# Altium project PE2.PrjPcb
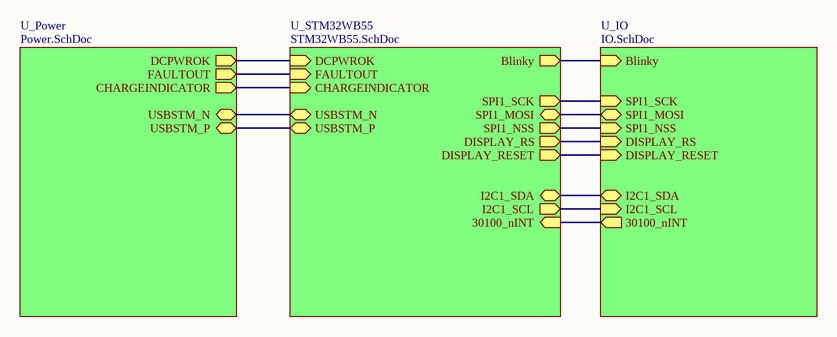
[diagram p0: TOP.SchDoc]
3 sheets, 50 parts. Net scope: hierarchical (ports join the sheet entries above them; power ports are global).
Sheets:
  TOP.SchDoc
    U_IO = IO.SchDoc
    U_Power = Power.SchDoc

## Sheet TOP.SchDoc: HB+SPO2 READER | TOP
size A4; DocumentNumber: 4; Revision: 1; SheetNumber: 1; SheetTotal: 4

### Sub-sheets
U_IO = IO.SchDoc: Blinky (in), I2C1_SDA (bidir), I2C1_SCL (in), SPI1_MOSI (bidir), SPI1_SCK (in), SPI1_NSS (in), DISPLAY_RS (in), DISPLAY_RESET (in), 30100_nINT (out)
U_Power = Power.SchDoc: DCPWROK (out), FAULTOUT (out), CHARGEINDICATOR (out), USBSTM_P (bidir), USBSTM_N (bidir)
U_STM32WB55 = STM32WB55.SchDoc (file not in this document): USBSTM_N (bidir), USBSTM_P (bidir), DCPWROK (in), FAULTOUT (in), CHARGEINDICATOR (in), Blinky (out), I2C1_SDA (bidir), I2C1_SCL (out), SPI1_MOSI (bidir), SPI1_SCK (out), SPI1_NSS (out), DISPLAY_RS (out), DISPLAY_RESET (out), 30100_nINT (in)

### Nets
CHARGEINDICATOR: sheet U_Power/CHARGEINDICATOR, sheet U_STM32WB55/CHARGEINDICATOR
DCPWROK: sheet U_Power/DCPWROK, sheet U_STM32WB55/DCPWROK
FAULTOUT: sheet U_Power/FAULTOUT, sheet U_STM32WB55/FAULTOUT
USBSTM_N: sheet U_Power/USBSTM_N, sheet U_STM32WB55/USBSTM_N
USBSTM_P: sheet U_Power/USBSTM_P, sheet U_STM32WB55/USBSTM_P
NetD1_1: sheet U_IO/Blinky, sheet U_STM32WB55/Blinky
NetU7_1: sheet U_IO/DISPLAY_RESET, sheet U_STM32WB55/DISPLAY_RESET
NetU7_3: sheet U_IO/DISPLAY_RS, sheet U_STM32WB55/DISPLAY_RS
NetU7_4: sheet U_IO/SPI1_MOSI, sheet U_STM32WB55/SPI1_MOSI
NetU7_5: sheet U_IO/SPI1_SCK, sheet U_STM32WB55/SPI1_SCK
NetU7_6: sheet U_IO/SPI1_NSS, sheet U_STM32WB55/SPI1_NSS
NetU7_7: sheet U_IO/I2C1_SCL, sheet U_STM32WB55/I2C1_SCL
NetU7_8: sheet U_IO/I2C1_SDA, sheet U_STM32WB55/I2C1_SDA
NetU7_9: sheet U_IO/30100_nINT, sheet U_STM32WB55/30100_nINT

### Notes on the sheet
- Title
- Size:
- Date:
- A4
- Number:
- Time:
- Revision:
- Sheet
- of
- ShareFox
- ©
- File:

## Sheet IO.SchDoc: HB+SPO2 READER | IO
size A4; DocumentNumber: 3; Revision: 1; SheetNumber: 4; SheetTotal: 4
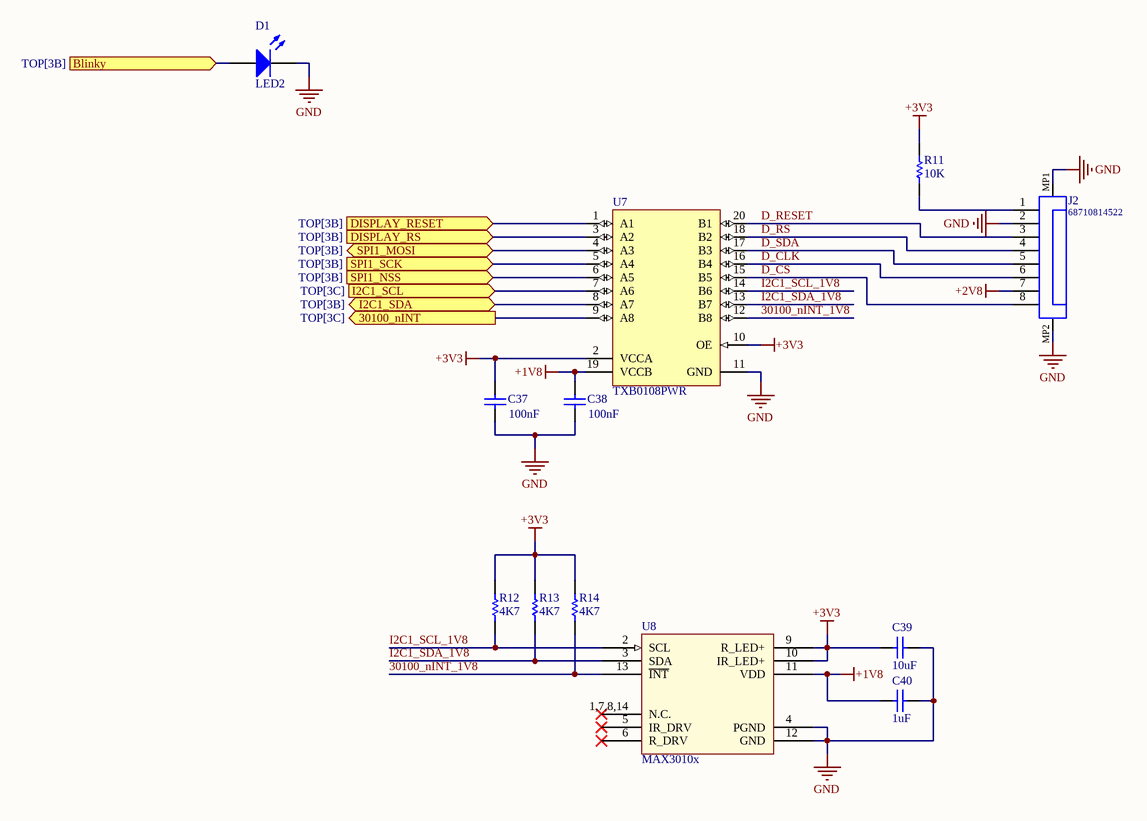
[diagram p1: IO.SchDoc]

### Parts
C37  value 100nF  [C_0603]  (hidden comment: Cap)
C38  value 100nF  [C_0603]  (hidden comment: Cap)
C39  value 10uF  [C_0603]  (hidden comment: Cap)
C40  value 1uF  [C_0603]  (hidden comment: Cap)
D1  LED2  [D-0603]
J2  68710814522  [68710814522]
R11  value 10K  [C_0603]  (hidden comment: Res1)
R12  value 4K7  [C_0603]  (hidden comment: Res1)
R13  value 4K7  [C_0603]  (hidden comment: Res1)
R14  value 4K7  [C_0603]  (hidden comment: Res1)
U7  TXB0108PWR  [PW0020A_L]
U8  MAX3010x  [OESIP14R560x330]

### Ports
30100_nINT (out, see TOP[3C]), Blinky (in, see TOP[3B]), DISPLAY_RESET (in, see TOP[3B]), DISPLAY_RS (in, see TOP[3B]), I2C1_SCL (in, see TOP[3C]), I2C1_SDA (bidir, see TOP[3B]), SPI1_MOSI (bidir, see TOP[3B]), SPI1_NSS (in, see TOP[3B]), SPI1_SCK (in, see TOP[3B])

### Nets
+1V8: C38.2 C40.2 U7.19(VCCB) U8.11(VDD)
+2V8: J2.7
+3V3: C37.2 C39.2 R11.1 R12.2 R13.2 R14.2 U7.2(VCCA) U7.10(OE) U8.9(R_LED+) U8.10(IR_LED+)
GND: C37.1 C38.1 C39.1 C40.1 D1.2(K) J2.2 J2.MP1 J2.MP2 U7.11(GND) U8.4(PGND) U8.12(GND)
30100_nINT_1V8: R14.1 U7.12(B8) U8.13(~{INT})
D_CLK: J2.6 U7.16(B4)
D_CS: J2.8 U7.15(B5)
D_RESET: J2.3 U7.20(B1)
D_RS: J2.4 U7.18(B2)
D_SDA: J2.5 U7.17(B3)
I2C1_SCL_1V8: R12.1 U7.14(B6) U8.2(SCL)
I2C1_SDA_1V8: R13.1 U7.13(B7) U8.3(SDA)
NetD1_1: D1.1(A) ; port Blinky
NetJ2_1: J2.1 R11.2
NetU7_1: U7.1(A1) ; port DISPLAY_RESET
NetU7_3: U7.3(A2) ; port DISPLAY_RS
NetU7_4: U7.4(A3) ; port SPI1_MOSI
NetU7_5: U7.5(A4) ; port SPI1_SCK
NetU7_6: U7.6(A5) ; port SPI1_NSS
NetU7_7: U7.7(A6) ; port I2C1_SCL
NetU7_8: U7.8(A7) ; port I2C1_SDA
NetU7_9: U7.9(A8) ; port 30100_nINT

Not connected (* = marked no-connect by the designer): U8 1,7,8,14(N.C.)* 5(IR_DRV)* 6(R_DRV)*

### Notes on the sheet
- Title
- Size:
- Date:
- A4
- Number:
- Time:
- Revision:
- Sheet
- of
- ShareFox
- ©
- File:

### Library data of the parts
C37-C40 = Cap: Capacitor; Published: 8-Jun-2000; LatestRevisionDate: 17-Jul-2002; LatestRevisionNote: Re-released for DXP Platform.; PackageReference: RAD-0.3; Publisher: Altium Limited; PackageDescription: Radial Cap, Thru-Hole; 2 Leads; 0.3 in Pin Spacing
D1 = LED2: Typical RED, GREEN, YELLOW, AMBER GaAs LED; Published: 8-Jun-2000; LatestRevisionDate: 17-Jul-2002; LatestRevisionNote: Re-released for DXP Platform.; PackageVersion: Feb-2002; PackageReference: 3.2X1.6X1.1; Publisher: Altium Limited; PackageDescription: SM LED; 2 Flat Leads
J2 = CMP-1502-01528-1: SMT ZIF Connectors WR-FPC, Horizontal, Bottom Contact, pitch 0.5 mm, 8 pins; Manufacturer: Wurth Elektronik; Contact Resistance: 20mOhm; Pitch: 0.5mm; Withstanding Voltage: 250VAC; Working Voltage: 50VAC; Pin Number: 8; Rated Current: 0.5A; Contact Design: BottomContact; Publisher: WurthElektronik; Orientation: Horizontal; Manufacturer URL: http://www.we-online.de; Part Number: 68710814522; Mounting Technology: SMT; Packaging: TapeandReel; Package Reference: 68710814522; Operating Temperature: -25to85degC; Datasheet URL: https://katalog.we-online.de/em/datasheet/68710814522.pdf
R11-R14 = Res1: Resistor; Published: 8-Jun-2000; LatestRevisionDate: 17-Jul-2002; LatestRevisionNote: Re-released for DXP Platform.; PackageReference: AXIAL-0.3; Publisher: Altium Limited; PackageDescription: Axial Device, Thru-Hole; 2 Leads; 0.3 in Pin Spacing
U7 = CMP-2000-07337-1: TXB0108 8-Bit Bidirectional Voltage-Level Translator with Auto-Direction Sensing and / +/- 15-kV ESD Protection, 1.2 to 3.6 V, -40 to 85 degC, 20-Pin TSSOP (PW), Green (RoHS & no Sb/Br), Tape and Reel; Manufacturer: Texas Instruments; Propagation Delay (Max): 4ns; Logic Function: Translator,Bidirectional; Input Type: Logic; Package Version: 4040064-5/G, 02/2011; Voltage - Supply: 1.2V~3.6V,1.65V~5.5V; Data Rate: 100Mbps; Other Names: 296-21527-6; Number of Channels: 8; Differential - Input: Output:No/No; Number of Outputs/Channel: 1; Product Training Modules: VoltageLevelTranslation; Dynamic Catalog: TXBSeries; Package Reference: PW20; Package Description: 20-Pin Small Outline Package Integrated Circuit, Body 6.5 x 4.4 mm, Pitch 0.65 mm; Category: IntegratedCircuits(ICs); Datasheet URL: http://www.ti.com/general/docs/lit/getliterature.tsp?genericPartNumber=TXB0108&fileType=pdf; Package / Case: 20-TSSOP(0.173",4.40mmWidth); Family: Logic-Translators; Standard Package: 1; Series: -; Manufacturer URL: http://www.ti.com/; Number of Bits: 8; Package URL: http://www.ti.com/litv/pdf/mpds362; Output Type: Logic; Datasheet Version: Rev. F, 12/2014; Packaging: Digi-Reel®; Operating Temperature: -40°C~85°C; Supplier Device Package: 20-TSSOP; Mounting Technology: SurfaceMount
U8 = MAX3010x: Pulse Oximeter and Heart-Rate Sensor IC  for Wearable Health

## Sheet Power.SchDoc: HB+SPO2 READER | POWER
size A4; DocumentNumber: 1; Revision: 1; SheetNumber: 2; SheetTotal: 4
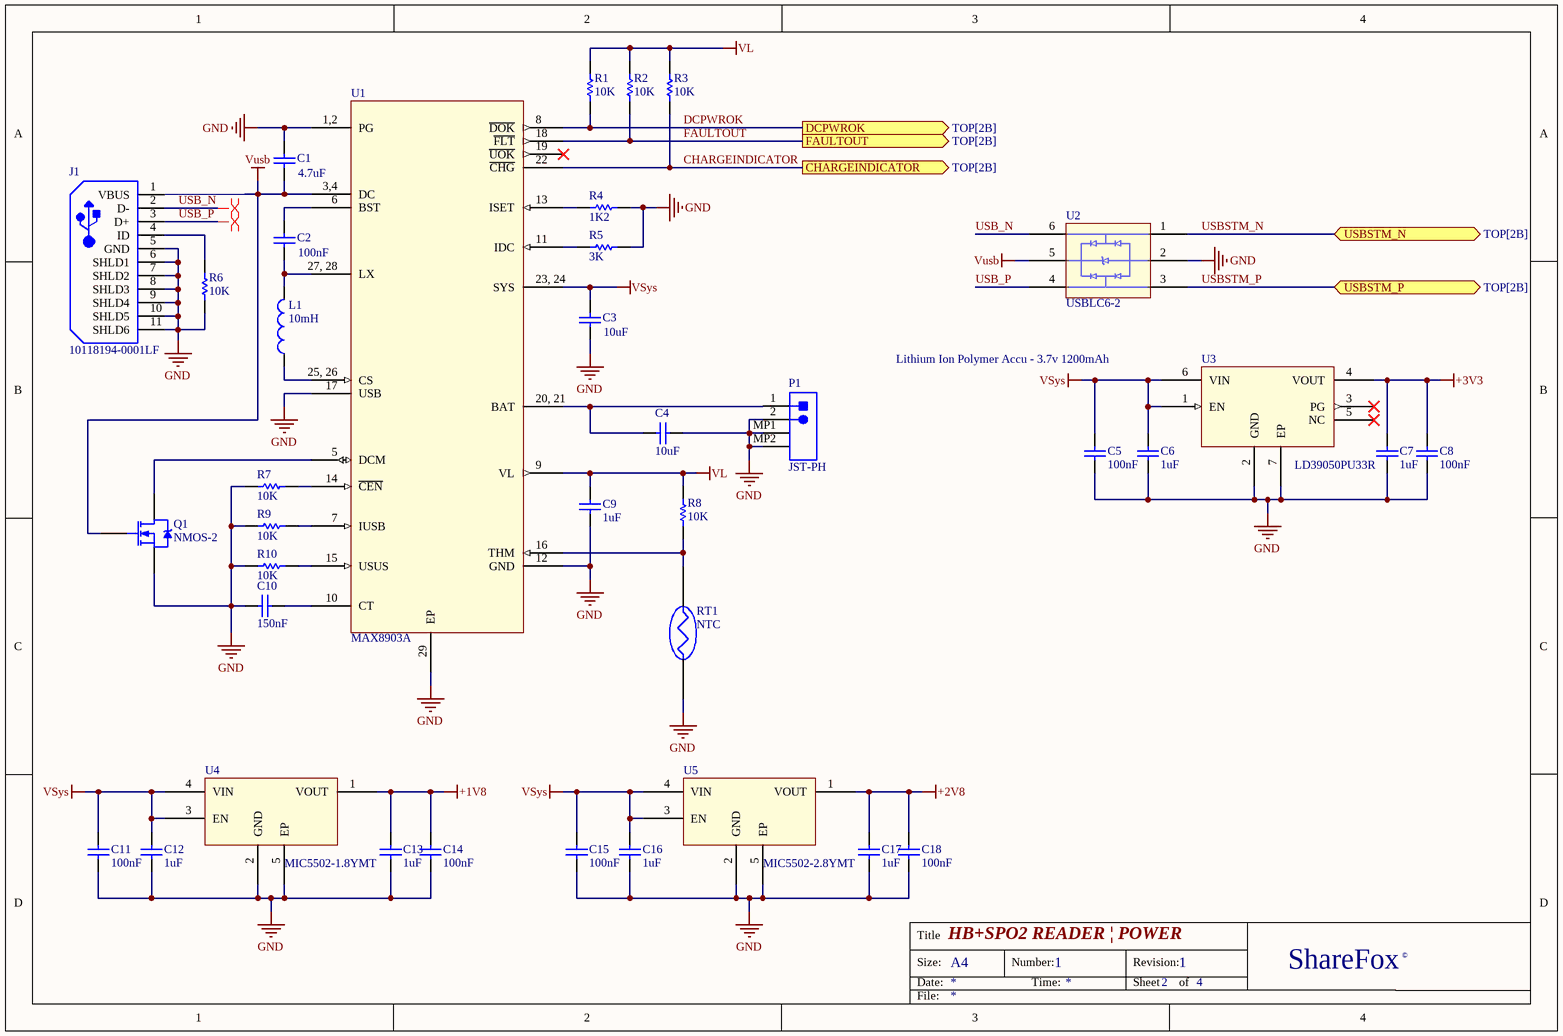
[diagram p2: Power.SchDoc]

### Parts
C1  value 4.7uF  [C_0603]  (hidden comment: Cap)
C2  value 100nF  [C_0603]  (hidden comment: Cap)
C3  value 10uF  [C_0603]  (hidden comment: Cap)
C4  value 10uF  [C_0603]  (hidden comment: Cap)
C5  value 100nF  [C_0603]  (hidden comment: Cap)
C6  value 1uF  [C_0603]  (hidden comment: Cap)
C7  value 1uF  [C_0603]  (hidden comment: Cap)
C8  value 100nF  [C_0603]  (hidden comment: Cap)
C9  value 1uF  [C_0603]  (hidden comment: Cap)
C10  value 150nF  [C_0603]  (hidden comment: Cap)
C11  value 100nF  [C_0603]  (hidden comment: Cap)
C12  value 1uF  [C_0603]  (hidden comment: Cap)
C13  value 1uF  [C_0603]  (hidden comment: Cap)
C14  value 100nF  [C_0603]  (hidden comment: Cap)
C15  value 100nF  [C_0603]  (hidden comment: Cap)
C16  value 1uF  [C_0603]  (hidden comment: Cap)
C17  value 1uF  [C_0603]  (hidden comment: Cap)
C18  value 100nF  [C_0603]  (hidden comment: Cap)
J1  10118194-0001LF  [FCI-10118194-0001LF-5_V]
L1  value 10mH  [L-0603]  (hidden comment: Inductor)
P1  JST-PH  [JST- S2B-PH-SM4-TB(LF)(SN)-2_V]
Q1  NMOS-2  [TO-220AB]
R1  value 10K  [C_0603]  (hidden comment: Res1)
R2  value 10K  [C_0603]  (hidden comment: Res1)
R3  value 10K  [C_0603]  (hidden comment: Res1)
R4  value 1K2  [C_0603]  (hidden comment: Res1)
R5  value 3K  [C_0603]  (hidden comment: Res1)
R6  value 10K  [C_0603]  (hidden comment: Res1)
R7  value 10K  [C_0603]  (hidden comment: Res1)
R8  value 10K  [C_0603]  (hidden comment: Res1)
R9  value 10K  [C_0603]  (hidden comment: Res1)
R10  value 10K  [C_0603]  (hidden comment: Res1)
RT1  NTC
U1  MAX8903A  [QFN28P40S400X400EP260x260]
U2  USBLC6-2  [SOT23-6P95R280X90]
U3  LD39050PU33R  [SON6P95S300X300EP237x149]
U4  MIC5502-1.8YMT  [DFN4P65S100x100EP48x48]
U5  MIC5502-2.8YMT  [DFN4P65S100x100EP48x48]

### Ports
CHARGEINDICATOR (out, see TOP[2B]), DCPWROK (out, see TOP[2B]), FAULTOUT (out, see TOP[2B]), USBSTM_N (bidir, see TOP[2B]), USBSTM_P (bidir, see TOP[2B])

### Nets
+1V8: C13.1 C14.1 U4.1(VOUT)
+2V8: C17.1 C18.1 U5.1(VOUT)
+3V3: C7.1 C8.1 U3.4(VOUT)
GND: C1.2 C3.1 C4.1 C5.2 C6.2 C7.2 C8.2 C9.2 C10.1 C11.2 C12.2 C13.2 C14.2 C15.2 C16.2 C17.2 C18.2 J1.5(GND) J1.6(SHLD1) J1.7(SHLD2) J1.8(SHLD3) J1.9(SHLD4) J1.10(SHLD5) J1.11(SHLD6) P1.2 P1.MP1 P1.MP2 Q1.3(S) R4.1 R5.1 R6.2 R7.2 R9.2 R10.2 RT1.1 U1.1,2(PG) U1.12(GND) U1.17(USB) U1.29(EP) U2.2 U3.2(GND) U3.7(EP) U4.2(GND) U4.5(EP) U5.2(GND) U5.5(EP)
VL: C9.1 R1.2 R2.2 R3.2 R8.1 U1.9(VL)
VSys: C3.2 C5.1 C6.1 C11.1 C12.1 C15.1 C16.1 U1.23,_24(SYS) U3.1(EN) U3.6(VIN) U4.3(EN) U4.4(VIN) U5.3(EN) U5.4(VIN)
Vusb: C1.1 J1.1(VBUS) Q1.1(G) U1.3,4(DC) U2.5
CHARGEINDICATOR: R3.1 U1.22(~{CHG}) ; port CHARGEINDICATOR
DCPWROK: R1.1 U1.8(~{DOK}) ; port DCPWROK
FAULTOUT: R2.1 U1.18(~{FLT}) ; port FAULTOUT
USB_N: J1.2(D-) U2.6
USB_P: J1.3(D+) U2.4
USBSTM_N: U2.1 ; port USBSTM_N
USBSTM_P: U2.3 ; port USBSTM_P
NetC2_1: C2.1 L1.2 U1.27,_28(LX)
NetC2_2: C2.2 U1.6(BST)
NetC4_2: C4.2 P1.1 U1.20,_21(BAT)
NetC10_2: C10.2 U1.10(CT)
NetJ1_4: J1.4(ID) R6.1
NetL1_1: L1.1 U1.25,_26(CS)
NetQ1_2: Q1.2(D) U1.5(DCM)
NetR4_2: R4.2 U1.13(ISET)
NetR5_2: R5.2 U1.11(IDC)
NetR7_1: R7.1 U1.14(~{CEN})
NetR8_2: R8.2 RT1.2 U1.16(THM)
NetR9_1: R9.1 U1.7(IUSB)
NetR10_1: R10.1 U1.15(USUS)

Not connected (* = marked no-connect by the designer): U1 19(~{UOK})*; U3 3(PG)* 5(NC)*

### Layout directives
differential pair: USB_N, USB_P

### Notes on the sheet
- (near P1) Lithium Ion Polymer Accu - 3.7v 1200mAh
- Title
- Size:
- Date:
- A4
- Number:
- Time:
- Revision:
- Sheet
- of
- ShareFox
- ©
- File:

### Library data of the parts
C1-C18 = Cap: Capacitor; Published: 8-Jun-2000; LatestRevisionDate: 17-Jul-2002; LatestRevisionNote: Re-released for DXP Platform.; PackageReference: RAD-0.3; Publisher: Altium Limited; PackageDescription: Radial Cap, Thru-Hole; 2 Leads; 0.3 in Pin Spacing
J1 = CMP-2000-05120-1: Micro USB B Type Receptacle, 1.8 A, -55 to 85 degC, 5-Pin SMD, RoHS, Tape and Reel; Manufacturer: Amphenol FCI; Body Orientation: RightAngle; Number of Contacts: 5; Pitch: 0.65mm; Gender: RCP; Rad Hard: No; Package Reference: 10118194-0001LF-5; Mounting: SurfaceMount; Manufacturer URL: http://www.fci.com/; Packaging: CutTape; Datasheet URL: https://datasheet.ciiva.com/26945/getdatasheetpartid-418619-26945695.pdf; Termination Method: Solder; Package Description: 5-Pin Surface Mount Device, Body 8.05 x 5.53 mm, Pitch 0.65 mm; Type: MicroUSBTypeB; Datasheet Version: Rev. A, 10/2011
L1 = Inductor: Code_IEC: 1005; Published: 8-Jun-2000; LatestRevisionDate: 29-May-2009; LatestRevisionNote: IPC-7351 Footprint Added.; PackageReference: 0402-A; Publisher: Altium Limited; PackageDescription: Chip Inductor; Code_JEITA: 0402
P1 = CMP-1755-00001-1: Male Header, Pitch 2 mm, 1 x 2 Position, Height 5.5 mm, -25 to 85 degC, RoHS, Tape and Reel; Current Rating: 3 A; ComponentLink1URL: http://www.jst.com/home2.html; Radiation Hardening: No; RoHSCompliant: True; Mount: Through Hole; Contact Material: Bronze; Package Quantity: 100; Width: 2.34 mm; DatasheetVersion: Dec-12; Height: 8.13 mm; Max Operating Temperature: 105degC; ComponentLink2Description: Datasheet; Lead Pitch: 0.1 inch; Contact Finish: Lead; Packaging: Bulk; Colour: Black; Contact Plating: Tin; Min Operating Temperature: -65degC; ComponentLink1Description: Manufacturer URL; PackageReference: S2B-PH-SM4-TB(LF)(SN)-2; PackageDescription: Male Header, Pitch 2 mm, 1 x 2 Position, Height 5.5 mm; ComponentLink2URL: http://www.jst-mfg.com/product/pdf/eng/ePH.pdf; Pins: 40; Length: 101.19 mm
Q1 = NMOS-2: N-Channel Power MOSFET; Note: Pin 2 is electrically connected to pin 4.; Published: 8-Jun-2000; LatestRevisionDate: 17-Jul-2002; LatestRevisionNote: Re-released for DXP Platform.; DatasheetVersion: PD-9.814; PackageVersion: Feb-1997; PackageReference: TO-220AB; Publisher: Altium Limited; PackageDescription: TO, Thru-Hole, Vertical, Heatsink Mounted; 3 In-Line Leads; Pitch 2.54 mm; ComponentLink1Description: Manufacturer Link; ComponentLink1URL: http://www.irf.com/
R1-R10 = Res1: Resistor; Published: 8-Jun-2000; LatestRevisionDate: 17-Jul-2002; LatestRevisionNote: Re-released for DXP Platform.; PackageReference: AXIAL-0.3; Publisher: Altium Limited; PackageDescription: Axial Device, Thru-Hole; 2 Leads; 0.3 in Pin Spacing
RT1 = NTC/PTC: 2322-640-63103
U1 = MAX8903A: 2A 1-Cell Li+ DC-DC Chargersfor USB and Adapter Power
U2 = USBLC6-2: Very low capacitance ESD protection
U3 = LD39050PUxxR: 500 mA low quiescent current and low noise voltage regulator
U4 U5 = MIC550x-x.xYMT: Single 300mA LDO

## Nets that join several sheets
+1V8: IO (C38.2 C40.2 U7.19 U8.11), Power (C13.1 C14.1 U4.1)
+2V8: IO (J2.7), Power (C17.1 C18.1 U5.1)
+3V3: IO (10 pins), Power (C7.1 C8.1 U3.4)
GND: IO (11 pins), Power (46 pins)